# EAGLE design minx_ajh_1_1 (EAGLE 9.3.2)
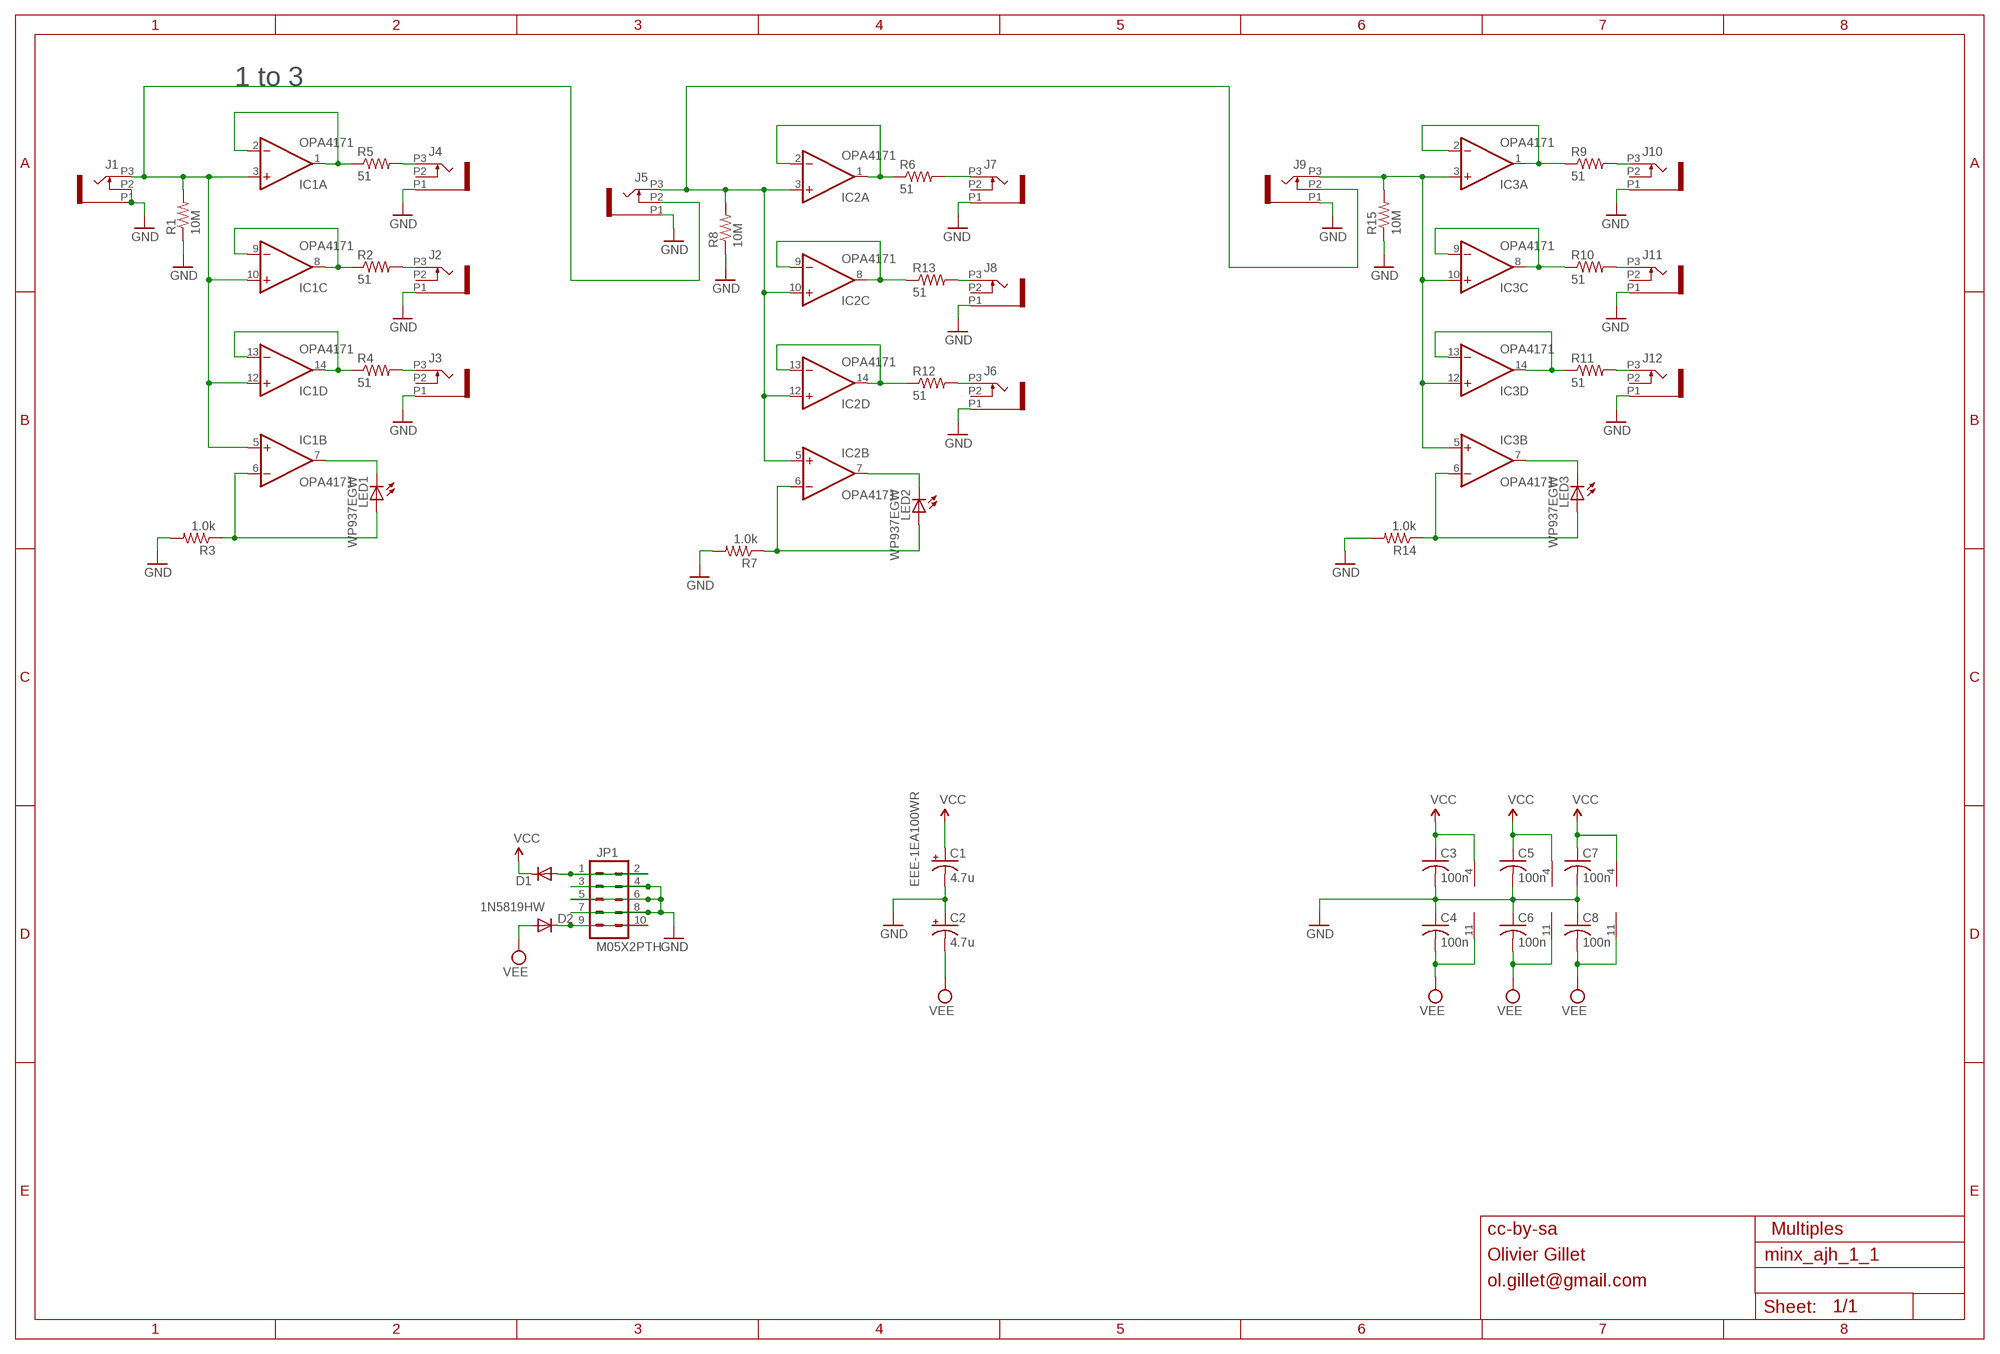
[diagram p0: schematic, sheet 1]

## Parts
C1  4.7u  CPOL-USA  [PANASONIC_A]
C2  4.7u  CPOL-USA  [PANASONIC_A]
C3  100n  C-USC0603  [C0603]
C4  100n  C-USC0603  [C0603]
C5  100n  C-USC0603  [C0603]
C6  100n  C-USC0603  [C0603]
C7  100n  C-USC0603  [C0603]
C8  100n  C-USC0603  [C0603]
D1  1N5819HW  DIODE-SOD123  [SOD123]
D2  1N5819HW  DIODE-SOD123  [SOD123]
IC1  OPA4171  TL074PW  [TSSOP14]
IC2  OPA4171  TL074PW  [TSSOP14]
IC3  OPA4171  TL074PW  [TSSOP14]
J1  PJ301_THONKICONN6  [WQP_PJ_301M6]
J2  PJ301_THONKICONN6  [WQP_PJ_301M6]
J3  PJ301_THONKICONN6  [WQP_PJ_301M6]
J4  PJ301_THONKICONN6  [WQP_PJ_301M6]
J5  PJ301_THONKICONN6  [WQP_PJ_301M6]
J6  PJ301_THONKICONN6  [WQP_PJ_301M6]
J7  PJ301_THONKICONN6  [WQP_PJ_301M6]
J8  PJ301_THONKICONN6  [WQP_PJ_301M6]
J9  PJ301_THONKICONN6  [WQP_PJ_301M6]
J10  PJ301_THONKICONN6  [WQP_PJ_301M6]
J11  PJ301_THONKICONN6  [WQP_PJ_301M6]
J12  PJ301_THONKICONN6  [WQP_PJ_301M6]
JP1  M05X2PTH  [AVR_ICSP]
LED1  WP937EGW  LED3MM  [LED3MM]
LED2  WP937EGW  LED3MM  [LED3MM]
LED3  WP937EGW  LED3MM  [LED3MM]
R1  10M  R-US_R0603  [R0603]
R2  51  R-US_R0603  [R0603]
R3  1.0k  R-US_R0603  [R0603]
R4  51  R-US_R0603  [R0603]
R5  51  R-US_R0603  [R0603]
R6  51  R-US_R0603  [R0603]
R7  1.0k  R-US_R0603  [R0603]
R8  10M  R-US_R0603  [R0603]
R9  51  R-US_R0603  [R0603]
R10  51  R-US_R0603  [R0603]
R11  51  R-US_R0603  [R0603]
R12  51  R-US_R0603  [R0603]
R13  51  R-US_R0603  [R0603]
R14  1.0k  R-US_R0603  [R0603]
R15  10M  R-US_R0603  [R0603]

## Nets
GND: C1.- C2.+ C3.2 C4.1 C5.2 C6.1 C7.2 C8.1 J1.P1 J1.P2 J2.P1 J3.P1 J4.P1 J5.P1 J6.P1 J7.P1 J8.P1 J9.P1 J10.P1 J11.P1 J12.P1 JP1.3 JP1.4 JP1.5 JP1.6 JP1.7 JP1.8 R1.1 R3.2 R7.2 R8.1 R14.2 R15.1
N$1: IC2.8(C:OUT) IC2.9(C:-IN) R13.1
N$2: IC3.1(A:OUT) IC3.2(A:-IN) R9.1
N$3: J2.P3 R2.2
N$4: J3.P3 R4.2
N$5: IC1.13(D:-IN) IC1.14(D:OUT) R4.1
N$6: D1.A JP1.1 JP1.2
N$7: IC3.13(D:-IN) IC3.14(D:OUT) R11.1
N$8: IC1.7(B:OUT) LED1.K(C)
N$10: J7.P3 R6.2
N$11: IC2.1(A:OUT) IC2.2(A:-IN) R6.1
N$12: J4.P3 R5.2
N$13: J8.P3 R13.2
N$14: J6.P3 R12.2
N$15: IC3.7(B:OUT) LED3.K(C)
N$16: J12.P3 R11.2
N$17: J11.P3 R10.2
N$18: IC3.6(B:-IN) LED3.A R14.1
N$19: IC3.8(C:OUT) IC3.9(C:-IN) R10.1
N$20: D2.C JP1.9 JP1.10
N$21: IC1.6(B:-IN) LED1.A R3.1
N$22: IC3.3(A:+IN) IC3.5(B:+IN) IC3.10(C:+IN) IC3.12(D:+IN) J9.P3 R15.2
N$23: J10.P3 R9.2
N$25: IC1.3(A:+IN) IC1.5(B:+IN) IC1.10(C:+IN) IC1.12(D:+IN) J1.P3 J5.P2 R1.2
N$26: IC2.13(D:-IN) IC2.14(D:OUT) R12.1
N$27: IC1.1(A:OUT) IC1.2(A:-IN) R5.1
N$28: IC2.7(B:OUT) LED2.K(C)
N$29: IC1.8(C:OUT) IC1.9(C:-IN) R2.1
N$31: IC2.3(A:+IN) IC2.5(B:+IN) IC2.10(C:+IN) IC2.12(D:+IN) J5.P3 J9.P2 R8.2
N$35: IC2.6(B:-IN) LED2.A R7.1
VCC: C1.+ C3.1 C5.1 C7.1 D1.C IC1.4(P:V+) IC2.4(P:V+) IC3.4(P:V+)
VEE: C2.- C4.2 C6.2 C8.2 D2.A IC1.11(P:V-) IC2.11(P:V-) IC3.11(P:V-)
Unconnected: J2.P2 J3.P2 J4.P2 J6.P2 J7.P2 J8.P2 J10.P2 J11.P2 J12.P2

## Notes on the sheet
- 1 to 3
- EEE-1EA100WR
- cc-by-sa | Multiples
- Olivier Gillet
- ol.gillet@gmail.com

## Library data of the parts
C1 C2 = rcl:CPOL-US: POLARIZED CAPACITOR, American symbol
C3-C8 = rcl:C-US: CAPACITOR, American symbol
D1 D2 = diode:DIODE-: DIODE
IC1-IC3 = linear:TL074: OP AMP
J1-J12 = og-pj301:PJ301_THONKICONN
JP1 = og-header:M05X2: Header 5x2 Standard 10-pin dual row 0.1" header. Commonly used with AVR-ISP. Use with Spark Fun Electronics SKU: PRT-00778
LED1-LED3 = led:LED: LED OSRAM: - CHIPLED LG R971, LG N971, LY N971, LG Q971, LY Q971, LO R971, LY R971 LH N974, LH R974 LS Q976, LO Q976, LY Q976 LO Q996 - Hyper CHIPLED LW Q18S LB Q993, LB Q99A, LB R99A - SideLED LS A670, LO A670, LY A670, LG A670, LP A670 LB A673, LV A673, LT A673, LW A673 LH A674 LY A675 LS A676, LA A676, LO A676, LY A676, LW A676 LS A679, LY A679, LG A679 - Hyper Micro SIDELED® LS Y876, LA Y876, LO Y876, LY Y876 LT Y87S - SmartLED LW L88C, LW L88S LB L89C, LB L89S, LG L890 LS L89K, LO L89K, LY L89K LS L896, LA L896, LO L896, LY L896 - TOPLED LS T670, LO T670, LY T670, LG T670, LP T670 LSG T670, LSP T670, LSY T670, LOP T670, LYG T670 LG T671, LOG T671, LSG T671 LB T673, LV T673, LT T673, LW T673 LH T674 LS T676, LA T676, LO T676, LY T676, LB T676, LH T676, LSB T676, LW T676 LB T67C, LV T67C, LT T67C, LS T67K, LO T67K, LY T67K, LW E67C LS E67B, LA E67B, LO E67B, LY E67B, LB E67C, LV E67C, LT E67C LW T67C LS T679, LY T679, LG T679 LS T770, LO T770, LY T770, LG T770, LP T770 LB T773, LV T773, LT T773, LW T773 LH T774 LS E675, LA E675, LY E675, LS T675 LS T776, LA T776, LO T776, LY T776, LB T776 LHGB T686 LT T68C, LB T68C - Hyper Mini TOPLED® LB M676 - Mini TOPLED Santana® LG M470 LS M47K, LO M47K, LY M47K Source: http://www.osram.convergy.de LUXEON: - LUMILED® LXK2-PW12-R00, LXK2-PW12-S00, LXK2-PW14-U00, LXK2-PW14-V00 LXK2-PM12-R00, LXK2-PM12-S00, LXK2-PM14-U00 LXK2-PE12-Q00, LXK2-PE12-R00, LXK2-PE12-S00, LXK2-PE14-T00, LXK2-PE14-U00 LXK2-PB12-K00, LXK2-PB12-L00, LXK2-PB12-M00, LXK2-PB14-N00, LXK2-PB14-P00, LXK2-PB14-Q00 LXK2-PR12-L00, LXK2-PR12-M00, LXK2-PR14-Q00, LXK2-PR14-R00 LXK2-PD12-Q00, LXK2-PD12-R00, LXK2-PD12-S00 LXK2-PH12-R00, LXK2-PH12-S00 LXK2-PL12-P00, LXK2-PL12-Q00, LXK2-PL12-R00 Source: www.luxeon.com KINGBRIGHT: KA-3528ASYC Source: www.kingbright.com
R1-R15 = rcl:R-US_: RESISTOR, American symbol

## Board
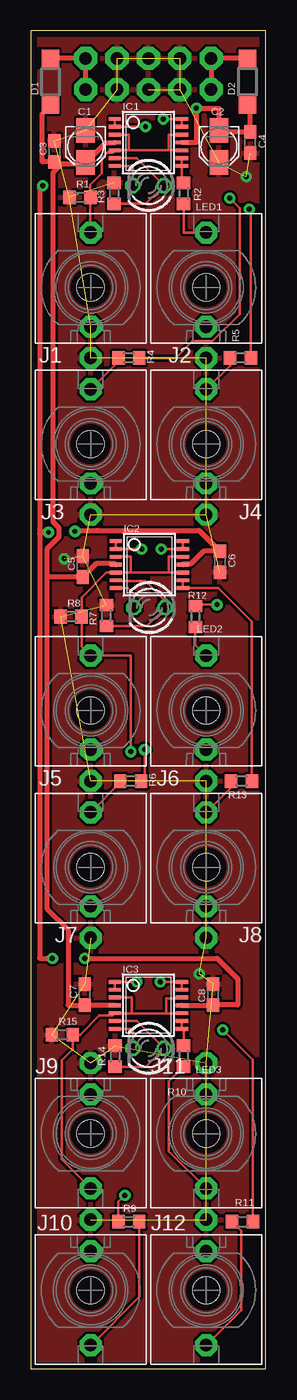
[diagram p1: board, top side]
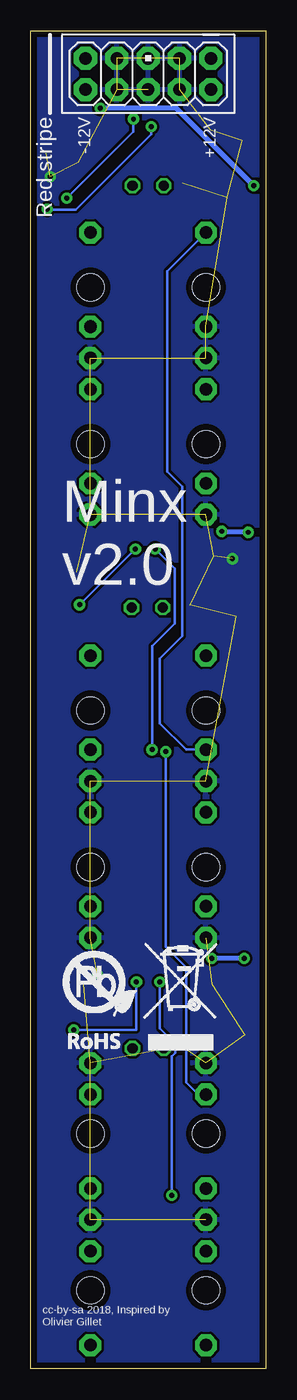
[diagram p2: board, bottom side, seen from below]

Size 19.03 x 108.43 mm. Coordinates in mm from the lower left corner, seen from the top.
Outline: 0,0 19.03,0 19.03,108.43 0,108.43 0,0
Copper layers (1*16): Top 0.035mm / dielectric 1.5mm / Bottom 0.035mm
Design rules "PCBCart-Standard *": minimum track width 8mil, minimum drill 0.4mm, track to track 8mil, track to pad 8mil, pad to pad 8mil, via to via 8mil, smd to smd 8mil, copper to edge 20mil, drill to drill 8mil, minimum pad ring 8mil, minimum via ring 10mil, stop-mask expansion 3mil, vias tented up to drill 25mil, thermal gap 8mil

### Footprints (pad centres in the part's own frame; a part is rotated, then mirrored left to right if it is on the bottom)
PANASONIC_A = smd 2 x 1.5: + 1.3,0; - -1.3,0
C0603 = smd 1.1 x 1: 1 -0.85,0; 2 0.85,0
SOD123 = smd 1.4 x 1.4: A 1.9,0; C -1.9,0
TSSOP14 = smd 0.305 x 0.991: 1 -1.905,-2.718; 2 -1.27,-2.718; 3 -0.635,-2.718; 4 0,-2.718; 5 0.635,-2.718; 6 1.27,-2.718; 7 1.905,-2.718; 8 1.905,2.718; 9 1.27,2.718; 10 0.635,2.718; 11 0,2.718; 12 -0.635,2.718; 13 -1.27,2.718; 14 -1.905,2.718
WQP_PJ_301M6 = drill 1.016 pad 1.778 octagon: P1 0,-5.715; P2 0,-3.175; P3 0,4.445 | hole 2.2: 0,0
AVR_ICSP = drill 1.016 pad 1.88 octagon: 1 -1.27,5.08; 2 1.27,5.08; 3 -1.27,2.54; 4 1.27,2.54; 5 -1.27,0; 6 1.27,0; 7 -1.27,-2.54; 8 1.27,-2.54; 9 -1.27,-5.08; 10 1.27,-5.08
LED3MM = drill 0.813 octagon: A -1.27,0; K 1.27,0
R0603 = smd 1 x 1.1: 1 -0.85,0; 2 0.85,0

### Placement (x,y rotation side)
C1  4.45,99.06 270 top
C2  15.24,99.06 270 top
C3  1.91,98.66 90 top
C4  17.78,99.38 90 top
C5  4.21,65.01 90 top
C6  15.32,65.41 90 top
C7  4.37,30.32 90 top
C8  14.76,30.32 270 top
D1  1.59,104.3 90 top
D2  17.54,104.3 270 top
IC1  9.53,99.38 270 top
IC2  9.6,65.17 270 top
IC3  9.53,29.45 270 top
J1  4.84,87.63 0 top
J2  14.21,87.63 0 top
J3  4.84,74.93 0 top
J4  14.21,74.93 0 top
J5  4.84,53.34 0 top
J6  14.21,53.34 0 top
J7  4.84,40.64 0 top
J8  14.21,40.64 0 top
J9  4.84,19.05 180 top
J10  4.84,6.35 180 top
J11  14.21,19.05 180 top
J12  14.21,6.35 180 top
JP1  9.53,104.93 270 bottom
LED1  9.53,95.89 180 top
LED2  9.6,61.67 180 top
LED3  9.53,25.96 180 top
R1  3.97,94.93 0 top
R2  12.38,95.25 270 top
R3  6.75,95.25 90 top
R4  7.94,81.92 180 top
R5  16.99,81.92 180 top
R6  8.1,47.62 180 top
R7  6.11,61.04 90 top
R8  3.25,60.96 0 top
R9  7.94,11.91 0 top
R10  12.38,25.32 270 top
R11  17.15,11.91 180 top
R12  13.34,60.96 270 top
R13  17.07,47.62 180 top
R14  6.83,25.32 90 top
R15  2.54,27.07 0 top
U$2  [ROHS]  17.3,25.24 0 bottom

### Tracks (layer width: path | path; a pad name or v marks a point on that pad's centre or on a via)
GND  (via drill 0.4)  (35 unrouted)
  other vias: 17.46,96.6 2.7,65.64 13.65,31.99
  pour Bottom: 0,108.43 0,0 19.05,0 19.05,108.43
  pour Top: 0,108.43 0,0 19.05,0 19.05,108.43
N$1
  Top 0.203: IC2.9 IC2.8 12.33,63.25 15.2,63.25 17.92,60.54 R13.1
N$2  (via drill 0.4)
  Top 0.203: IC3.2 IC3.1 v8.57,31.35 | v7.62,14.05 7.09,13.52 R9.1
  Bottom 0.203: v8.57,31.35 8.57,27.57 7.34,26.33 7.34,25.58 7.62,25.3 v7.62,14.05
N$3
  Top 0.203: J2.P3 12.38,92.08 R2.2
N$4
  Top 0.203: R4.2 7.09,81.62 J3.P3
N$5  (via drill 0.4)
  Top 0.203: IC1.13 IC1.14 v10.72,101.28 | R4.1 11.75,81.92 13.09,83.26 14.7,83.26 16.91,85.47 16.91,94.06 v16.11,94.85
  Bottom 0.203: v10.72,101.28 10.72,101.12 10.72,100.25 v16.11,94.85
N$6
  Top 0.406: JP1.2 JP1.1 D1.A
N$7  (via drill 0.4)
  Top 0.203: IC3.13 IC3.14 v10.48,31.35 | v15.56,27.46 18,25.03 R11.1
  Bottom 0.203: v15.56,27.46 10.48,27.46 v10.48,31.35
N$8
  Top 0.203: IC1.7 8.26,97.47 LED1.K
N$10
  Top 0.203: R6.2 7.25,47.49 J7.P3
N$11  (via drill 0.4)
  Top 0.203: IC2.1 IC2.2 v8.97,66.44 | v9.21,50.16 9.21,47.89 R6.1
  Bottom 0.203: v8.97,66.44 7.38,64.85 7.38,60.4 9.21,58.58 v9.21,50.16
N$12
  Top 0.203: R5.2 16.14,81.3 J4.P3
N$13
  Top 0.203: R13.2 16.22,47.09 J8.P3
N$14
  Top 0.203: R12.2 13.34,58.66 J6.P3
N$15
  Top 0.203: IC3.7 8.26,27.54 LED3.K
N$16
  Top 0.203: J12.P3 17.03,4.73 17.03,11.17 R11.2
N$17
  Top 0.203: J11.P3 11.19,17.62 11.19,23.28 R10.2
N$18
  Top 0.203: R14.1 9.31,24.47 LED3.A 8.57,28.18 IC3.6
N$19
  Top 0.203: IC3.9 IC3.8 12.38,27.4 R10.1
N$20
  Top 0.406: JP1.9 14.61,106.12 | 14.61,106.12 JP1.10 | D2.C 14.68,106.2 14.61,106.12
N$21
  Top 0.203: R3.1 9.31,94.4 LED1.A 8.57,98.11 IC1.6
N$22
  Top 0.203: 8.18,28.81 IC3.5 6.63,28.64 5.55,28.64 3.98,27.07 R15.2 3.39,25.88 2.5,24.98 2.5,16.95 J9.P3 | 8.18,28.81 10.95,28.81 | 10.95,28.81 IC3.10 | IC3.3 8.18,30.08 8.18,28.81 | IC3.12 12.16,30 10.95,30 10.95,28.81
N$23
  Top 0.203: J10.P3 4.88,1.91 8.79,5.81 R9.2
N$25
  Top 0.203: 7.94,98.74 8.49,98.74 10.64,98.74 11.19,98.74 | 11.19,98.74 IC1.10 | IC1.3 7.94,100.01 7.94,98.74 | IC1.12 11.19,100.01 11.19,98.74 | 7.94,98.74 IC1.5 6.63,98.56 6.19,98.56 5.74,98.12 5.74,96.87 4.82,95.95 R1.2 4.82,92.1 J1.P3
  Bottom 0.203: J1.P3 7.98,88.94 7.98,72.71 6.75,71.48 6.75,59.37 8.57,57.55 8.57,52.31 6.43,50.16 J5.P2
N$26  (via drill 0.4)
  Top 0.203: IC2.14 IC2.13 v10.56,66.44 | v15.08,61.91 13.44,61.91
  Top 0.406: 13.44,61.91 R12.1
  Bottom 0.203: v10.56,66.44 v15.08,61.91
N$27  (via drill 0.4)
  Top 0.203: IC1.1 IC1.2 v9.29,100.65 | v17.7,93.98 17.75,93.93 17.8,93.93 17.8,81.95 R5.1
  Bottom 0.203: v17.7,93.98 17.66,93.94 15.4,93.94 9.29,100.05 v9.29,100.65
N$28
  Top 0.203: IC2.7 7.86,63.26 8.33,62.79 LED2.K
N$29
  Top 0.203: IC1.9 IC1.8 12.24,96.24
  Top 0.254: 12.24,96.24 R2.1
N$31  (via drill 0.4)
  Top 0.203: IC2.3 8.1,65.8 8.1,64.53 | IC2.12 11.19,65.8 11.19,64.53 | 8.1,64.53 IC2.5 6.87,64.51 6.11,64.51 4.1,62.51 R8.2 4.1,58.52 J5.P3 8.1,57.78 v8.1,50.01 | 11.19,64.53 IC2.10 | 8.1,64.53 11.19,64.53
  Bottom 0.203: v8.1,50.01 8.1,34.17 6.46,32.53 6.46,23.21 5.48,22.23 J9.P2
N$35
  Top 0.203: IC2.6 6.97,63.82 9.29,63.82 10.87,62.23 LED2.A | R7.1 9.39,60.18 LED2.A
  Top 0.406: LED2.A | R7.1
VCC
  Top 0.203: D1.C 0.93,101.74 | IC3.4
  Top 0.406: 0.93,101.74 0.93,97.8 0.94,97.81 C3.1 2.11,97.61 2.46,97.61 | IC2.4 6.81,65.24 5.29,65.24 C5.1 1.36,64.16 1.34,64.14 | 2.46,97.61 4.29,97.61 C1.+ 6.06,99.38 IC1.4 | IC3.4 6.78,29.47 C7.1 4.36,29.46 3.02,29.46 3.02,35.56 1.34,37.24 1.34,64.14 | 2.46,97.61 1.82,96.97 1.82,68.61 2.29,68.14 2.29,67.43 1.34,66.48 1.34,64.14
VEE  (via drill 0.4)
  Top 0.406: IC2.11 12.4,65.24 12.99,65.24 14,66.25 C6.2 13.63,67.94 5.4,67.94 5.38,67.92 3.63,67.92 v3.57,67.87 | IC1.11 13.41,99.38 v13.41,102.16 15.24,102.16 C2.- 15.37,100.23 C4.2 17.78,102.16 D2.A | v0.96,95.89 0.71,95.63 0.71,68.02 0.71,67.71 | 0.71,67.71 0.71,33.26 v1.75,33.26 | 0.71,67.71 0.79,67.79 v1.43,67.79 | v4.37,33.26 15.08,33.26 16.75,31.59 16.75,29.45 16.73,29.47 C8.2 14.74,29.45 IC3.11
  Bottom 0.406: v1.75,33.26 v4.37,33.26 | v1.43,67.79 3.49,67.79 v3.57,67.87 | v0.96,95.89 7.23,102.16 v13.41,102.16

### Text on the board
bPlace: Red stripe
bNames: +12V | -12V | Minx / v2.0 | cc-by-sa 2018, Inspired by / Olivier Gillet